# Altium schematic sheet LED.SchDoc
size A4; SheetNumber: 2; SheetTotal: 4
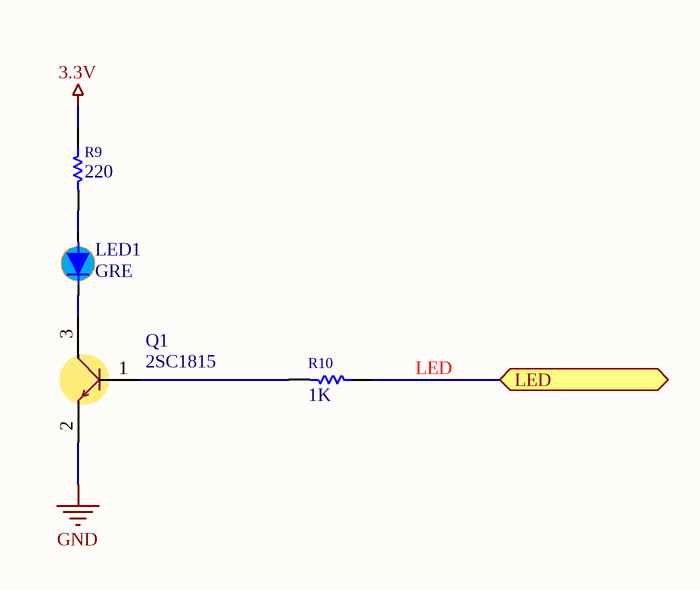
[diagram p0: LED.SchDoc]

## Parts
LED1  GRE  [Led 3mm_D]
Q1  2SC1815  [SOT23]
R9  220  [R2012-0805]
R10  1K  [R2012-0805]

## Ports
LED (bidir)

## Nets
3.3V: R9.1
GND: Q1.2(E)
LED: R10.1 ; port LED
NetLED1_1: LED1.1(A) R9.2
NetLED1_2: LED1.2(K) Q1.3(C)
NetQ1_1: Q1.1(B) R10.2

## Library data of the parts
LED1 = Led
Q1 = NPN_SMD: SMD TRANSISTOR
R9 R10 = Resistor <SMD>: Resistor; AEMS Code: 1200430; Vendor: Digikey; Tollerance: 5%; Published: 17-3-2009; Publisher: Hoang Nguyen; ComponentLink1Description: Digikey Part Link; ComponentLink2Description: Open Datasheet; ComponentLink2URL: H:\LIBRARY\LIBRARY.Datasheet\
  R9: Value: 220
  R10: Value: 1K